# EAGLE design MxxxCol (EAGLE 6.6.0)

## Sheet 1 of 6
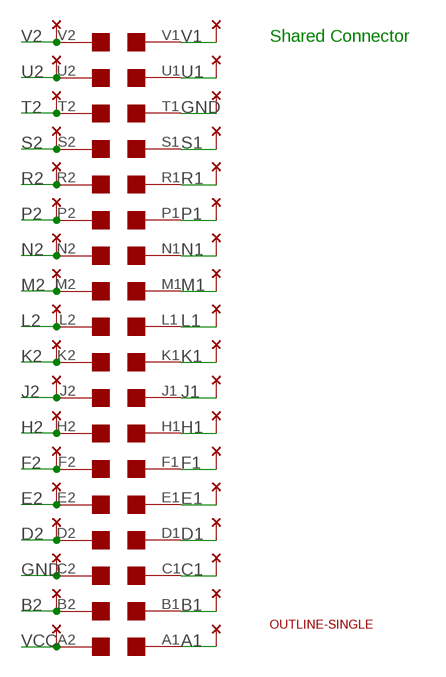
[diagram p0: schematic, sheet 1]

### Parts
U$1  EDGE-2CONNECTOR  [EDGE-CON2]
U$2  OUTLINE-SINGLE  [SINGLE]
U$4  THRU-HOLE2A  [THRU-HOLEA]

### Nets
A1: U$1.A1 U$4.A1 ; also sheet 2,3,4,5,6
B1: U$1.B1 U$4.B1 ; also sheet 2,3,4,5,6
B2: U$1.B2 U$4.B2
C1: U$1.C1 U$4.C1 ; also sheet 2,3,4,5,6
D1: U$1.D1 U$4.D1 ; also sheet 2,3,4,5,6
D2: U$1.D2 U$4.D2 ; also sheet 2,3,4,5,6
E1: U$1.E1 U$4.E1 ; also sheet 2,3,4,5
E2: U$1.E2 U$4.E2 ; also sheet 2,3,4,5,6
F1: U$1.F1 U$4.F1 ; also sheet 2,3,4,5,6
F2: U$1.F2 U$4.F2 ; also sheet 2,3,4,5,6
GND [Power]: U$1.C2 U$1.T1 U$4.C2 U$4.T1 ; also sheet 2,3,4,5,6
H1: U$1.H1 U$4.H1 ; also sheet 2,3,4,5,6
H2: U$1.H2 U$4.H2 ; also sheet 2,3,4,5,6
J1: U$1.J1 U$4.J1 ; also sheet 2,3,4,5,6
J2: U$1.J2 U$4.J2 ; also sheet 2,3,4,5,6
K1: U$1.K1 U$4.K1 ; also sheet 2,3,4,5,6
K2: U$1.K2 U$4.K2 ; also sheet 2,3,4,5,6
L1: U$1.L1 U$4.L1 ; also sheet 2,3,4,5
L2: U$1.L2 U$4.L2 ; also sheet 2,3,4,5,6
M1: U$1.M1 U$4.M1 ; also sheet 2,3,4,5,6
M2: U$1.M2 U$4.M2 ; also sheet 2,3,4,5,6
N1: U$1.N1 U$4.N1 ; also sheet 2,3,4,5,6
N2: U$1.N2 U$4.N2 ; also sheet 2,3,4,5,6
P1: U$1.P1 U$4.P1 ; also sheet 2,3,4,5,6
P2: U$1.P2 U$4.P2 ; also sheet 2,3,4,5,6
R1: U$1.R1 U$4.R1 ; also sheet 2,3,4,5,6
R2: U$1.R2 U$4.R2 ; also sheet 2,3,4,5,6
S1: U$1.S1 U$4.S1 ; also sheet 2,3,4,5
S2: U$1.S2 U$4.S2 ; also sheet 2,3,4,5,6
T2: U$1.T2 U$4.T2 ; also sheet 2,3,4,5,6
U1: U$1.U1 U$4.U1 ; also sheet 2,3,4
U2: U$1.U2 U$4.U2 ; also sheet 2,3,4,5,6
V1: U$1.V1 U$4.V1 ; also sheet 2,3,4
V2: U$1.V2 U$4.V2 ; also sheet 2,3,4,5,6
VCC [Power]: U$1.A2 U$4.A2 ; also sheet 2,3,4,5,6

### Notes on the sheet
- Shared Connector

## Sheet 2 of 6
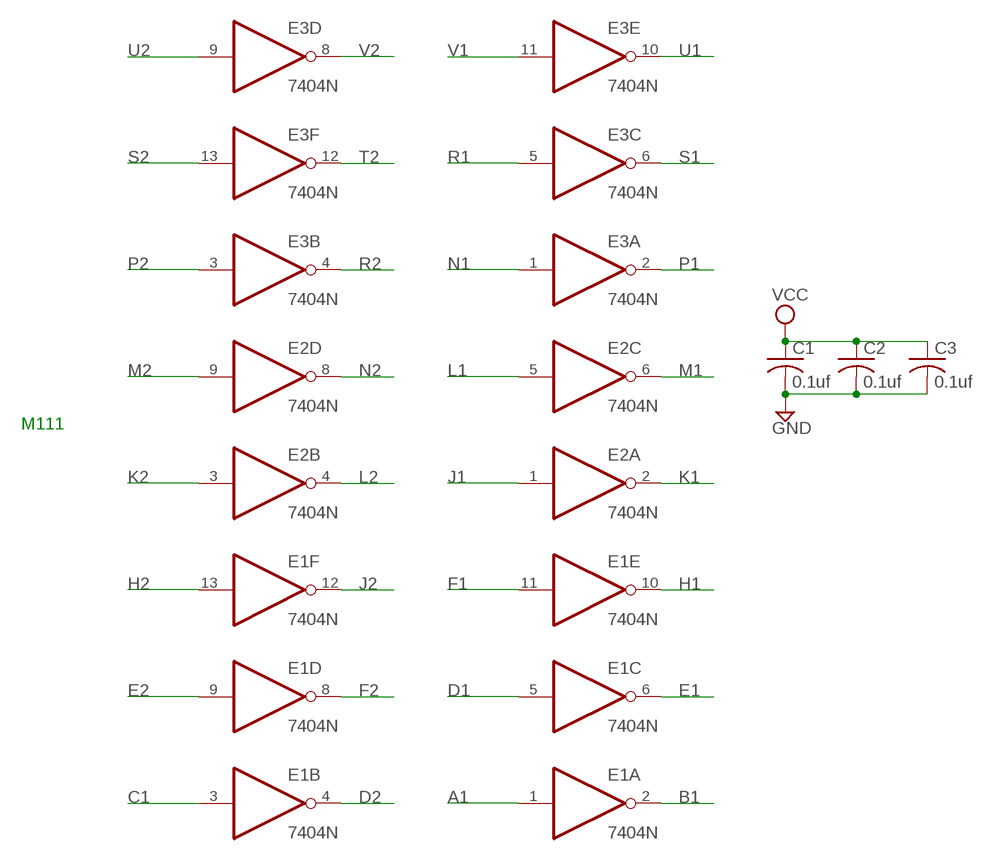
[diagram p1: schematic, sheet 2]

### Parts
C1  0.1uf  C-US050-025X075  [C050-025X075]
C2  0.1uf  C-US050-025X075  [C050-025X075]
C3  0.1uf  C-US050-025X075  [C050-025X075]
E1  7404N  [DIL14]
E2  7404N  [DIL14]
E3  7404N  [DIL14]

### Nets
A1: E1.1(A:I) ; also sheet 1,3,4,5,6
B1: E1.2(A:O) ; also sheet 1,3,4,5,6
C1: E1.3(B:I) ; also sheet 1,3,4,5,6
D1: E1.5(C:I) ; also sheet 1,3,4,5,6
D2: E1.4(B:O) ; also sheet 1,3,4,5,6
E1: E1.6(C:O) ; also sheet 1,3,4,5
E2: E1.9(D:I) ; also sheet 1,3,4,5,6
F1: E1.11(E:I) ; also sheet 1,3,4,5,6
F2: E1.8(D:O) ; also sheet 1,3,4,5,6
GND [Power]: C1.2 C2.2 C3.2 ; also sheet 1,3,4,5,6
H1: E1.10(E:O) ; also sheet 1,3,4,5,6
H2: E1.13(F:I) ; also sheet 1,3,4,5,6
J1: E2.1(A:I) ; also sheet 1,3,4,5,6
J2: E1.12(F:O) ; also sheet 1,3,4,5,6
K1: E2.2(A:O) ; also sheet 1,3,4,5,6
K2: E2.3(B:I) ; also sheet 1,3,4,5,6
L1: E2.5(C:I) ; also sheet 1,3,4,5
L2: E2.4(B:O) ; also sheet 1,3,4,5,6
M1: E2.6(C:O) ; also sheet 1,3,4,5,6
M2: E2.9(D:I) ; also sheet 1,3,4,5,6
N1: E3.1(A:I) ; also sheet 1,3,4,5,6
N2: E2.8(D:O) ; also sheet 1,3,4,5,6
P1: E3.2(A:O) ; also sheet 1,3,4,5,6
P2: E3.3(B:I) ; also sheet 1,3,4,5,6
R1: E3.5(C:I) ; also sheet 1,3,4,5,6
R2: E3.4(B:O) ; also sheet 1,3,4,5,6
S1: E3.6(C:O) ; also sheet 1,3,4,5
S2: E3.13(F:I) ; also sheet 1,3,4,5,6
T2: E3.12(F:O) ; also sheet 1,3,4,5,6
U1: E3.10(E:O) ; also sheet 1,3,4
U2: E3.9(D:I) ; also sheet 1,3,4,5,6
V1: E3.11(E:I) ; also sheet 1,3,4
V2: E3.8(D:O) ; also sheet 1,3,4,5,6
VCC [Power]: C1.1 C2.1 C3.1 ; also sheet 1,3,4,5,6
Unconnected: E2.10(E:O) E2.11(E:I) E2.12(F:O) E2.13(F:I)

### Notes on the sheet
- M111

## Sheet 3 of 6
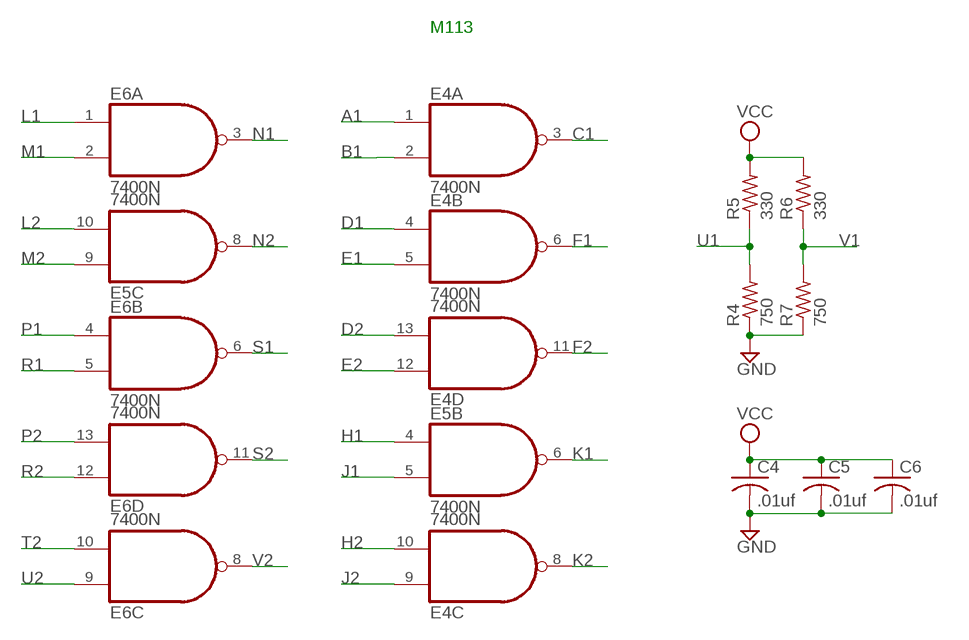
[diagram p2: schematic, sheet 3]

### Parts
C4  .01uf  C-US050-025X075  [C050-025X075]
C5  .01uf  C-US050-025X075  [C050-025X075]
C6  .01uf  C-US050-025X075  [C050-025X075]
E4  7400N  [DIL14]
E5  7400N  [DIL14]
E6  7400N  [DIL14]
R4  750  R-US_0207/10  [0207/10]
R5  330  R-US_0207/10  [0207/10]
R6  330  R-US_0207/10  [0207/10]
R7  750  R-US_0207/10  [0207/10]

### Nets
A1: E4.1(A:I0) ; also sheet 1,2,4,5,6
B1: E4.2(A:I1) ; also sheet 1,2,4,5,6
C1: E4.3(A:O) ; also sheet 1,2,4,5,6
D1: E4.4(B:I0) ; also sheet 1,2,4,5,6
D2: E4.13(D:I1) ; also sheet 1,2,4,5,6
E1: E4.5(B:I1) ; also sheet 1,2,4,5
E2: E4.12(D:I0) ; also sheet 1,2,4,5,6
F1: E4.6(B:O) ; also sheet 1,2,4,5,6
F2: E4.11(D:O) ; also sheet 1,2,4,5,6
GND [Power]: C4.2 C5.2 C6.2 R4.1 R7.1 ; also sheet 1,2,4,5,6
H1: E5.4(B:I0) ; also sheet 1,2,4,5,6
H2: E4.10(C:I1) ; also sheet 1,2,4,5,6
J1: E5.5(B:I1) ; also sheet 1,2,4,5,6
J2: E4.9(C:I0) ; also sheet 1,2,4,5,6
K1: E5.6(B:O) ; also sheet 1,2,4,5,6
K2: E4.8(C:O) ; also sheet 1,2,4,5,6
L1: E6.1(A:I0) ; also sheet 1,2,4,5
L2: E5.10(C:I1) ; also sheet 1,2,4,5,6
M1: E6.2(A:I1) ; also sheet 1,2,4,5,6
M2: E5.9(C:I0) ; also sheet 1,2,4,5,6
N1: E6.3(A:O) ; also sheet 1,2,4,5,6
N2: E5.8(C:O) ; also sheet 1,2,4,5,6
P1: E6.4(B:I0) ; also sheet 1,2,4,5,6
P2: E6.13(D:I1) ; also sheet 1,2,4,5,6
R1: E6.5(B:I1) ; also sheet 1,2,4,5,6
R2: E6.12(D:I0) ; also sheet 1,2,4,5,6
S1: E6.6(B:O) ; also sheet 1,2,4,5
S2: E6.11(D:O) ; also sheet 1,2,4,5,6
T2: E6.10(C:I1) ; also sheet 1,2,4,5,6
U1: R4.2 R5.1 ; also sheet 1,2,4
U2: E6.9(C:I0) ; also sheet 1,2,4,5,6
V1: R6.1 R7.2 ; also sheet 1,2,4
V2: E6.8(C:O) ; also sheet 1,2,4,5,6
VCC [Power]: C4.1 C5.1 C6.1 R5.2 R6.2 ; also sheet 1,2,4,5,6
Unconnected: E5.1(A:I0) E5.2(A:I1) E5.3(A:O) E5.11(D:O) E5.12(D:I0) E5.13(D:I1)

### Notes on the sheet
- M113

## Sheet 4 of 6
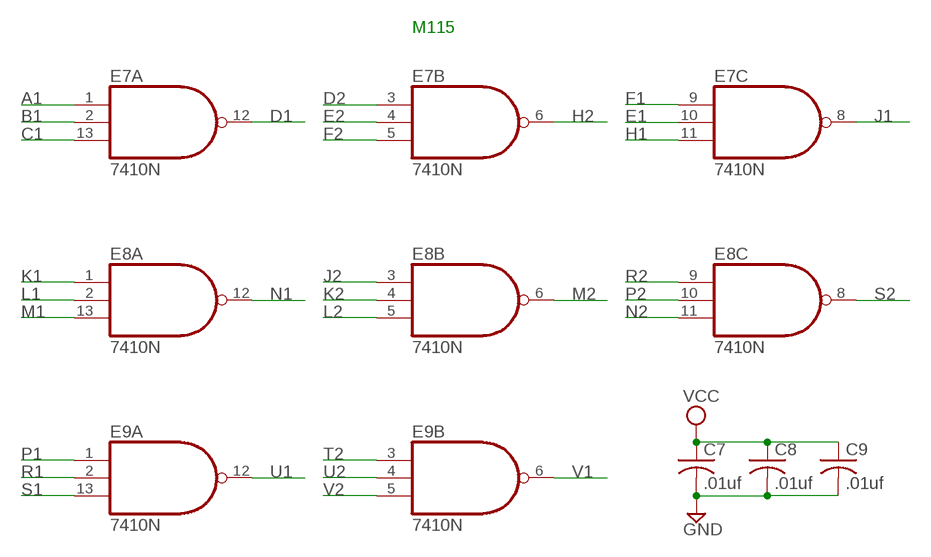
[diagram p3: schematic, sheet 4]

### Parts
C7  .01uf  C-US050-025X075  [C050-025X075]
C8  .01uf  C-US050-025X075  [C050-025X075]
C9  .01uf  C-US050-025X075  [C050-025X075]
E7  7410N  [DIL14]
E8  7410N  [DIL14]
E9  7410N  [DIL14]

### Nets
A1: E7.1(A:I0) ; also sheet 1,2,3,5,6
B1: E7.2(A:I1) ; also sheet 1,2,3,5,6
C1: E7.13(A:I2) ; also sheet 1,2,3,5,6
D1: E7.12(A:O) ; also sheet 1,2,3,5,6
D2: E7.3(B:I0) ; also sheet 1,2,3,5,6
E1: E7.10(C:I1) ; also sheet 1,2,3,5
E2: E7.4(B:I1) ; also sheet 1,2,3,5,6
F1: E7.9(C:I0) ; also sheet 1,2,3,5,6
F2: E7.5(B:I2) ; also sheet 1,2,3,5,6
GND [Power]: C7.2 C8.2 C9.2 ; also sheet 1,2,3,5,6
H1: E7.11(C:I2) ; also sheet 1,2,3,5,6
H2: E7.6(B:O) ; also sheet 1,2,3,5,6
J1: E7.8(C:O) ; also sheet 1,2,3,5,6
J2: E8.3(B:I0) ; also sheet 1,2,3,5,6
K1: E8.1(A:I0) ; also sheet 1,2,3,5,6
K2: E8.4(B:I1) ; also sheet 1,2,3,5,6
L1: E8.2(A:I1) ; also sheet 1,2,3,5
L2: E8.5(B:I2) ; also sheet 1,2,3,5,6
M1: E8.13(A:I2) ; also sheet 1,2,3,5,6
M2: E8.6(B:O) ; also sheet 1,2,3,5,6
N1: E8.12(A:O) ; also sheet 1,2,3,5,6
N2: E8.11(C:I2) ; also sheet 1,2,3,5,6
P1: E9.1(A:I0) ; also sheet 1,2,3,5,6
P2: E8.10(C:I1) ; also sheet 1,2,3,5,6
R1: E9.2(A:I1) ; also sheet 1,2,3,5,6
R2: E8.9(C:I0) ; also sheet 1,2,3,5,6
S1: E9.13(A:I2) ; also sheet 1,2,3,5
S2: E8.8(C:O) ; also sheet 1,2,3,5,6
T2: E9.3(B:I0) ; also sheet 1,2,3,5,6
U1: E9.12(A:O) ; also sheet 1,2,3
U2: E9.4(B:I1) ; also sheet 1,2,3,5,6
V1: E9.6(B:O) ; also sheet 1,2,3
V2: E9.5(B:I2) ; also sheet 1,2,3,5,6
VCC [Power]: C7.1 C8.1 C9.1 ; also sheet 1,2,3,5,6
Unconnected: E9.8(C:O) E9.9(C:I0) E9.10(C:I1) E9.11(C:I2)

### Notes on the sheet
- M115

## Sheet 5 of 6
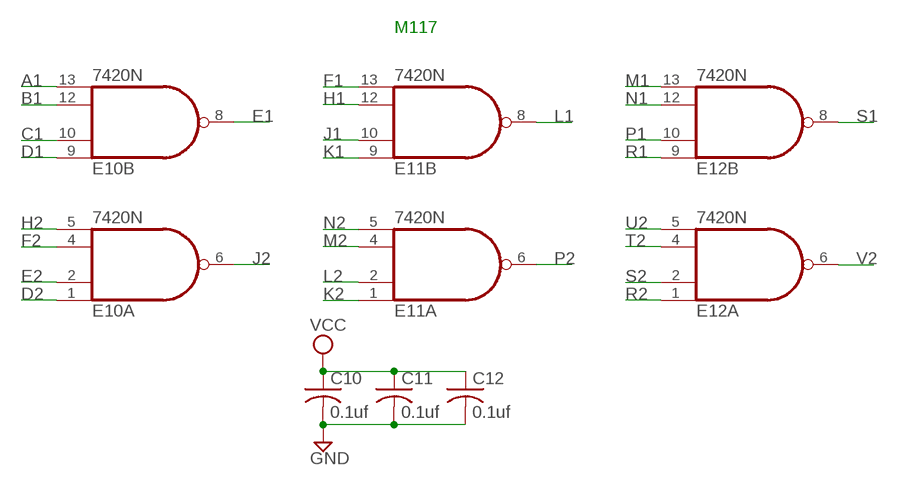
[diagram p4: schematic, sheet 5]

### Parts
C10  0.1uf  C-US050-025X075  [C050-025X075]
C11  0.1uf  C-US050-025X075  [C050-025X075]
C12  0.1uf  C-US050-025X075  [C050-025X075]
E10  7420N  74S20N  [DIL14]
E11  7420N  74S20N  [DIL14]
E12  7420N  74S20N  [DIL14]

### Nets
A1: E10.13(B:I3) ; also sheet 1,2,3,4,6
B1: E10.12(B:I2) ; also sheet 1,2,3,4,6
C1: E10.10(B:I1) ; also sheet 1,2,3,4,6
D1: E10.9(B:I0) ; also sheet 1,2,3,4,6
D2: E10.1(A:I0) ; also sheet 1,2,3,4,6
E1: E10.8(B:O) ; also sheet 1,2,3,4
E2: E10.2(A:I1) ; also sheet 1,2,3,4,6
F1: E11.13(B:I3) ; also sheet 1,2,3,4,6
F2: E10.4(A:I2) ; also sheet 1,2,3,4,6
GND [Power]: C10.2 C11.2 C12.2 ; also sheet 1,2,3,4,6
H1: E11.12(B:I2) ; also sheet 1,2,3,4,6
H2: E10.5(A:I3) ; also sheet 1,2,3,4,6
J1: E11.10(B:I1) ; also sheet 1,2,3,4,6
J2: E10.6(A:O) ; also sheet 1,2,3,4,6
K1: E11.9(B:I0) ; also sheet 1,2,3,4,6
K2: E11.1(A:I0) ; also sheet 1,2,3,4,6
L1: E11.8(B:O) ; also sheet 1,2,3,4
L2: E11.2(A:I1) ; also sheet 1,2,3,4,6
M1: E12.13(B:I3) ; also sheet 1,2,3,4,6
M2: E11.4(A:I2) ; also sheet 1,2,3,4,6
N1: E12.12(B:I2) ; also sheet 1,2,3,4,6
N2: E11.5(A:I3) ; also sheet 1,2,3,4,6
P1: E12.10(B:I1) ; also sheet 1,2,3,4,6
P2: E11.6(A:O) ; also sheet 1,2,3,4,6
R1: E12.9(B:I0) ; also sheet 1,2,3,4,6
R2: E12.1(A:I0) ; also sheet 1,2,3,4,6
S1: E12.8(B:O) ; also sheet 1,2,3,4
S2: E12.2(A:I1) ; also sheet 1,2,3,4,6
T2: E12.4(A:I2) ; also sheet 1,2,3,4,6
U2: E12.5(A:I3) ; also sheet 1,2,3,4,6
V2: E12.6(A:O) ; also sheet 1,2,3,4,6
VCC [Power]: C10.1 C11.1 C12.1 ; also sheet 1,2,3,4,6

### Notes on the sheet
- M117

## Sheet 6 of 6
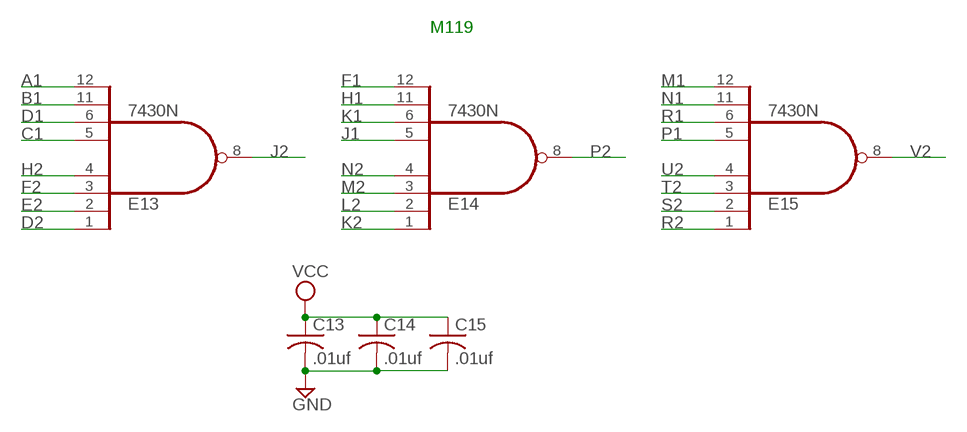
[diagram p5: schematic, sheet 6]

### Parts
C13  .01uf  C-US050-025X075  [C050-025X075]
C14  .01uf  C-US050-025X075  [C050-025X075]
C15  .01uf  C-US050-025X075  [C050-025X075]
E13  7430N  [DIL14]
E14  7430N  [DIL14]
E15  7430N  [DIL14]

### Nets
A1: E13.12(I7) ; also sheet 1,2,3,4,5
B1: E13.11(I6) ; also sheet 1,2,3,4,5
C1: E13.5(I4) ; also sheet 1,2,3,4,5
D1: E13.6(I5) ; also sheet 1,2,3,4,5
D2: E13.1(I0) ; also sheet 1,2,3,4,5
E2: E13.2(I1) ; also sheet 1,2,3,4,5
F1: E14.12(I7) ; also sheet 1,2,3,4,5
F2: E13.3(I2) ; also sheet 1,2,3,4,5
GND [Power]: C13.2 C14.2 C15.2 ; also sheet 1,2,3,4,5
H1: E14.11(I6) ; also sheet 1,2,3,4,5
H2: E13.4(I3) ; also sheet 1,2,3,4,5
J1: E14.5(I4) ; also sheet 1,2,3,4,5
J2: E13.8(O) ; also sheet 1,2,3,4,5
K1: E14.6(I5) ; also sheet 1,2,3,4,5
K2: E14.1(I0) ; also sheet 1,2,3,4,5
L2: E14.2(I1) ; also sheet 1,2,3,4,5
M1: E15.12(I7) ; also sheet 1,2,3,4,5
M2: E14.3(I2) ; also sheet 1,2,3,4,5
N1: E15.11(I6) ; also sheet 1,2,3,4,5
N2: E14.4(I3) ; also sheet 1,2,3,4,5
P1: E15.5(I4) ; also sheet 1,2,3,4,5
P2: E14.8(O) ; also sheet 1,2,3,4,5
R1: E15.6(I5) ; also sheet 1,2,3,4,5
R2: E15.1(I0) ; also sheet 1,2,3,4,5
S2: E15.2(I1) ; also sheet 1,2,3,4,5
T2: E15.3(I2) ; also sheet 1,2,3,4,5
U2: E15.4(I3) ; also sheet 1,2,3,4,5
V2: E15.8(O) ; also sheet 1,2,3,4,5
VCC [Power]: C13.1 C14.1 C15.1 ; also sheet 1,2,3,4,5

### Notes on the sheet
- M119

## Power pins joined to a net without a drawn wire
GND: E1.7(P:GND) E2.7(P:GND) E3.7(P:GND) E4.7(P:GND) E5.7(P:GND) E6.7(P:GND) E7.7(P:GND) E8.7(P:GND) E9.7(P:GND) E10.7(P:GND) E11.7(P:GND) E12.7(P:GND) E13.7(GND) E14.7(GND) E15.7(GND)
VCC: E1.14(P:VCC) E2.14(P:VCC) E3.14(P:VCC) E4.14(P:VCC) E5.14(P:VCC) E6.14(P:VCC) E7.14(P:VCC) E8.14(P:VCC) E9.14(P:VCC) E10.14(P:VCC) E11.14(P:VCC) E12.14(P:VCC) E13.14(VCC) E14.14(VCC) E15.14(VCC)

## Library data of the parts
C1-C15 = rcl:C-US: CAPACITOR, American symbol
E1-E3 = 74xx-us:74*04: Hex INVERTER
E4-E6 = 74xx-us:74*00: Quad 2-input NAND gate
E7-E9 = 74xx-us:74*10: Triple 3-input NAND gate
E10-E12 = 74xx-us:74*20: Dual 4-input NAND gate
E13-E15 = 74xx-us:74*30: 8-input NAND gate
R4-R7 = rcl:R-US_: RESISTOR, American symbol
U$1 = dec-con:EDGE-2: Double-Sided DEC edge connector.
U$2 = dec-con:OUTLINE-*: Board outlines for DEC boards.
U$4 = dec-con:THRU-HOLE2: Thru-Hole addition to double-sided edge connector.

## Net classes
1 Power: width 0.381 mm

## Board
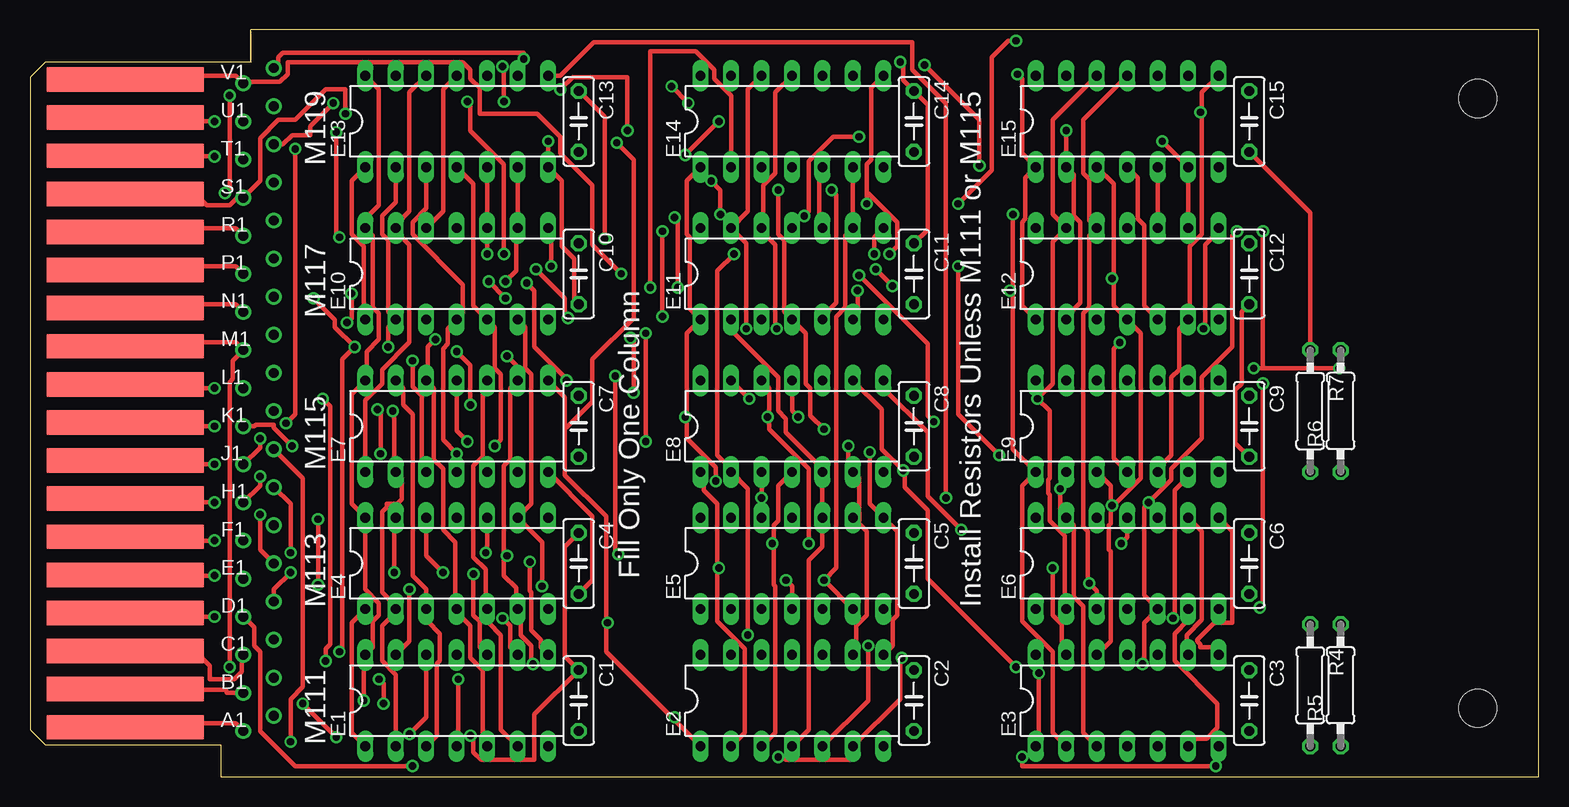
[diagram p6: board, top side]
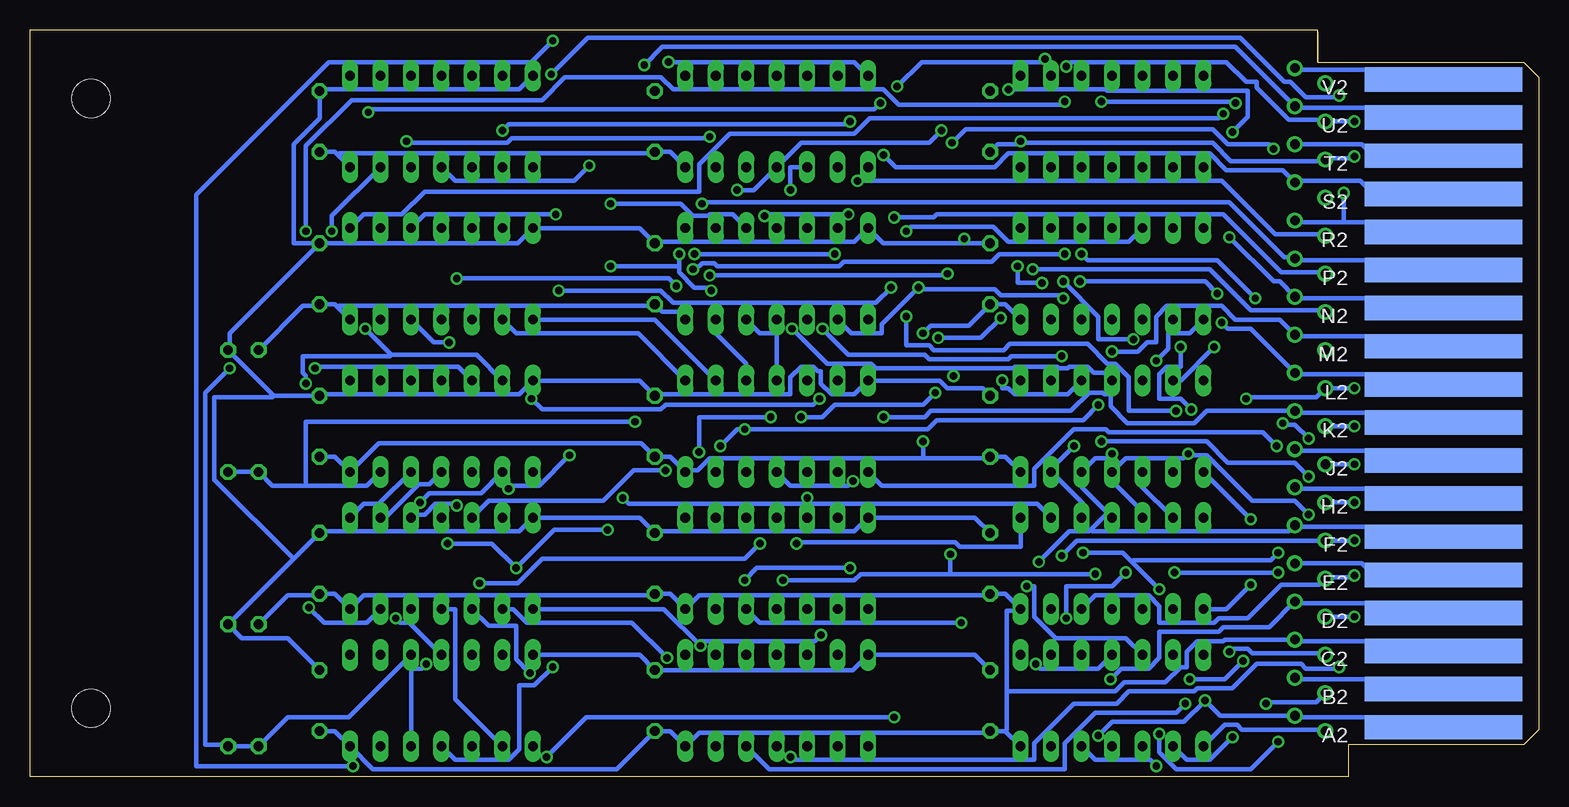
[diagram p7: board, bottom side, seen from below]

Size 125.73 x 62.23 mm. Coordinates in mm from the lower left corner, seen from the top.
Copper layers (1*16): Top 0.035mm / dielectric 1.5mm / Bottom 0.035mm
Design rules "15mils": minimum track width 15mil, minimum drill 24mil, track to track 15mil, track to pad 10mil, pad to pad 10mil, via to via 10mil, smd to smd 10mil, copper to edge 13mil, drill to drill 10mil, minimum pad ring 10mil, minimum via ring 8mil, stop-mask expansion 0mil, vias tented up to drill 0mil, thermal gap 10mil

### Footprints (pad centres in the part's own frame; a part is rotated, then mirrored left to right if it is on the bottom)
C050-025X075 = drill 0.813 octagon: 1 -2.54,0; 2 2.54,0
DIL14 = drill 0.813 long: 1 -7.62,-3.81; 2 -5.08,-3.81; 3 -2.54,-3.81; 4 0,-3.81; 5 2.54,-3.81; 6 5.08,-3.81; 7 7.62,-3.81; 8 7.62,3.81; 9 5.08,3.81; 10 2.54,3.81; 11 0,3.81; 12 -2.54,3.81; 13 -5.08,3.81; 14 -7.62,3.81
0207/10 = drill 0.813 octagon: 1 -5.08,0; 2 5.08,0
EDGE-CON2 = smd 13.106 x 2.032: A1 7.938,4.128; B1 7.938,7.303; C1 7.938,10.477; D1 7.938,13.652; E1 7.938,16.828; F1 7.938,20.003; H1 7.938,23.177; J1 7.938,26.352; K1 7.938,29.527; L1 7.938,32.703; M1 7.938,35.877; N1 7.938,39.053; P1 7.938,42.227; R1 7.938,45.403; S1 7.938,48.578; T1 7.938,51.752; U1 7.938,54.928; V1 7.938,58.102 | smd 13.106 x 2.032 bottom: A2 7.938,4.128; B2 7.938,7.303; C2 7.938,10.477; D2 7.938,13.652; E2 7.938,16.828; F2 7.938,20.003; H2 7.938,23.177; J2 7.938,26.352; K2 7.938,29.527; L2 7.938,32.703; M2 7.938,35.877; N2 7.938,39.053; P2 7.938,42.227; R2 7.938,45.403; S2 7.938,48.578; T2 7.938,51.752; U2 7.938,54.928; V2 7.938,58.102
SINGLE = hole 3.175: 120.65,56.515; 120.65,5.715
THRU-HOLEA = drill 0.813 pad 1.27: A1 17.78,3.81; A2 20.32,5.08; B1 17.78,6.985; B2 20.32,8.255; C1 17.78,10.16; C2 20.32,11.43; D1 17.78,13.335; D2 20.32,14.605; E1 17.78,16.51; E2 20.32,17.78; F1 17.78,19.685; F2 20.32,20.955; H1 17.78,22.86; H2 20.32,24.13; J1 17.78,26.035; J2 20.32,27.305; K1 17.78,29.21; K2 20.32,30.48; L1 17.78,32.385; L2 20.32,33.655; M1 17.78,35.56; M2 20.32,36.83; N1 17.78,38.735; N2 20.32,40.005; P1 17.78,41.91; P2 20.32,43.18; R1 17.78,45.085; R2 20.32,46.355; S1 17.78,48.26; S2 20.32,49.53; T1 17.78,51.435; T2 20.32,52.705; U1 17.78,54.61; U2 20.32,55.88; V1 17.78,57.785; V2 20.32,59.055

### Placement (x,y rotation side)
C1  45.72,6.35 270 top
C2  73.66,6.35 270 top
C3  101.6,6.35 270 top
C4  45.72,17.78 270 top
C5  73.66,17.78 270 top
C6  101.6,17.78 270 top
C7  45.72,29.21 270 top
C8  73.66,29.21 270 top
C9  101.6,29.21 270 top
C10  45.72,41.91 270 top
C11  73.66,41.91 270 top
C12  101.6,41.91 270 top
C13  45.72,54.61 270 top
C14  73.66,54.61 270 top
C15  101.6,54.61 270 top
E1  35.56,6.35 0 top
E2  63.5,6.35 0 top
E3  91.44,6.35 0 top
E4  35.56,17.78 0 top
E5  63.5,17.78 0 top
E6  91.44,17.78 0 top
E7  35.56,29.21 0 top
E8  63.5,29.21 0 top
E9  91.44,29.21 0 top
E10  35.56,41.91 0 top
E11  63.5,41.91 0 top
E12  91.44,41.91 0 top
E13  35.56,54.61 0 top
E14  63.5,54.61 0 top
E15  91.44,54.61 0 top
R4  106.68,7.62 270 top
R5  109.22,7.62 90 top
R6  109.22,30.48 90 top
R7  106.68,30.48 270 top
U$1  0,0 0 top
U$2  0,0 0 top
U$4  0,0 0 top

### Tracks (layer width: path | path; a pad name or v marks a point on that pad's centre or on a via)
A1  (via drill 0.61)
  Top 0.381: E7.1 27.94,31.37 29.34,32.77 29.34,33.91 31.62,36.2 31.62,44.32 30.48,45.47 E10.13 30.61,45.85 30.61,46.1 31.62,47.12 31.62,57.02 E13.12 | E4.1 26.8,12.83 26.8,3.68 E1.1 | U$4.A1 17.15,4.45 8,4.45 8,4.19 U$1.A1 | v24,16 v24,21.46
  Bottom 0.381: U$4.A1 17.91,3.94 24.77,3.94 25.15,4.32 26.16,4.32 E1.1 | v24,21.46 E7.1 | v24,16 26.04,13.97 E4.1
B1  (via drill 0.61)
  Top 0.381: U$4.B1 16.38,6.99 16.38,7.11 16.26,7.24 8,7.24 U$1.B1 | E10.12 34.42,47.12 34.42,57.28 E13.11 | E1.2 30.48,8.51 29.34,9.65 29.34,12.57 30.48,13.72 E4.2 30.35,14.1 30.35,14.35 29.34,15.37 29.34,22.1 29.72,22.48 29.72,22.73 30.61,22.73 30.99,23.11 30.99,24.89 E7.2 30.35,25.53 30.35,30.35 v30.23,30.48 | v52.71,38.35 v52.71,45.47 | v25.53,3.3 v22.73,6.1
  Bottom 0.381: E10.12 34.16,44.58 44.2,44.58 45.47,45.85 52.32,45.85 v52.71,45.47 | v52.71,38.35 52.71,35.94 50.8,35.94 50.42,35.56 44.58,35.56 44.07,36.07 37.59,36.07 35.94,34.42 35.31,34.42 34.16,33.27 34.16,30.48 v30.23,30.48 | U$4.B1 18.54,6.22 22.61,6.22 v22.73,6.1 | v25.53,3.3 27.43,1.4 29.34,1.4 E1.2
B2
  Bottom 0.381: U$4.B2 20.19,8.13 8.76,8.13 U$1.B2
C1  (via drill 0.61)
  Top 0.381: U$4.C1 17.65,10.03 17.65,8.76 17.02,8.13 14.99,8.13 14.99,9.27 13.84,10.41 8,10.41 U$1.C1 | E13.5 E10.10 v38.1,43.56 | E7.13 31.12,32.38 31.12,30.99 31.88,30.23 31.88,16.76 33.02,15.62 E4.3 33.15,13.84 33.15,12.95 34.16,11.94 34.16,9.65 33.91,9.4 33.91,3.43 E1.3 | v23.62,39.88 25.4,38.1 25.4,37.47 v27.05,35.81 26.04,34.8 26.04,10.67 v25.78,10.41
  Bottom 0.381: v38.1,43.56 37.59,43.05 26.8,43.05 v23.62,39.88 | v27.05,35.81 29.85,33.02 E7.13 | U$4.C1 17.91,10.29 23.88,10.29 24.26,10.67 25.53,10.67 v25.78,10.41
D1  (via drill 0.61)
  Top 0.381: v15.37,13.34 8,13.34 8,13.59 U$1.D1 | E13.6 E10.9 40.51,45.59 40.51,42.16 v39.62,41.27 | E1.5 37.72,2.92 37.72,8.89 36.7,9.91 36.7,12.57 35.56,13.72 E4.4 35.43,14.1 35.43,19.56 34.42,20.57 34.42,25.65 33.66,26.42 33.66,32.38 E7.12 33.15,33.15 33.15,35.81 v33.78,36.45 | U$4.D1 18.67,12.45 18.67,10.92 19.18,10.41 19.18,3.81 22.1,0.89 v31.88,0.89
  Bottom 0.381: v15.37,13.34 U$4.D1 | v39.62,41.27 36.7,38.35 36.7,36.45 v33.78,36.45 | v31.88,0.89 32.39,1.4 36.96,1.4 E1.5
D2  (via drill 0.61)
  Top 0.381: E10.1 27.81,38.23 27.81,44.2 26.8,45.21 26.8,49.66 E13.1 | E7.3 32.64,25.78 32.64,31.75 31.88,32.51 v31.88,34.67 | E1.4 35.69,2.67 v35.69,8.13 | E4.13 30.35,21.46 v30.35,17.02 | v21.72,17.02 20.32,15.62 U$4.D2
  Bottom 0.381: E4.13 33.15,24.26 33.15,25.4 E7.3 | v31.88,34.67 30.86,35.69 30.86,36.96 29.08,36.96 E10.1 | v35.69,8.13 34.8,9.02 32.51,9.02 31.62,9.91 31.62,12.06 26.67,12.06 26.29,12.45 22.48,12.45 U$4.D2 20.19,14.48 8.76,14.48 U$1.D2 | v21.72,17.02 v30.35,17.02
E1  (via drill 0.61)
  Top 0.381: E1.6 39.24,3.94 39.24,11.81 38.23,12.83 38.23,13.84 E4.5 37.97,14.1 37.97,17.27 36.96,18.29 36.96,25.91 37.72,26.67 37.72,32.64 E7.10 | E10.8 43.43,45.47 v43.43,42.55 | v41.4,41.15 42.04,40.51 42.04,35.81 44.7,33.15 v44.7,33.02 | v15.37,16.76 8,16.76 U$1.E1
  Bottom 0.381: E4.5 36.96,15.11 32.51,15.11 31.62,14.22 31.62,12.83 27.05,12.83 26.67,13.21 24.26,13.21 21.46,16 18.29,16 U$4.E1 17.65,16.64 15.49,16.64 v15.37,16.76 | v43.43,42.55 43.43,41.15 v41.4,41.15 | v44.7,33.02 44.7,32.38 44.2,32.38 43.69,31.88 39.24,31.88 E7.10
E2  (via drill 0.61)
  Top 0.381: E13.2 30.48,47.88 29.34,46.74 29.34,45.21 29.85,44.7 29.85,38.73 E10.2 29.85,37.47 v29.85,35.81 | E1.9 40.01,10.79 40.01,12.57 v39.37,13.21 | v34.42,17.02 33.02,18.41 E4.12 | v28.96,30.61 29.21,30.35 v29.21,26.92 | U$4.E2 19.18,18.92 v19.18,21.84
  Bottom 0.381: U$4.E2 14.73,17.78 13.84,16.89 8,16.89 U$1.E2 | E4.12 33.02,22.1 35.56,24.64 E7.4 34.42,26.54 29.59,26.54 v29.21,26.92 29.08,26.8 27.69,26.8 23.88,22.99 20.32,22.99 v19.18,21.84 | v39.37,13.21 39.37,15.88 35.56,15.88 v34.42,17.02 | v29.85,35.81 29.85,34.16 30.99,34.16 31.62,33.53 31.62,31.5 29.85,31.5 v28.96,30.61
F1  (via drill 0.61)
  Top 0.381: v15.37,19.68 8,19.68 8,19.94 U$1.F1 | E14.12 59.82,57.28 59.82,47.12 E11.13 59.69,44.45 v59.69,37.34 | v41.91,9.4 41.78,9.53 41.78,10.92 40.89,11.81 40.89,13.72 E4.6 40.51,14.1 40.51,15.75 39.5,16.76 39.5,18.41 | 39.5,18.41 39.5,25.91 40.01,26.42 40.01,32.38 E7.9 40.51,33.15 40.51,34.29 v39.75,35.05 | v39.75,18.41 39.5,18.41
  Bottom 0.381: v15.37,19.68 U$4.F1 38.48,19.68 v39.75,18.41 | E1.11 36.7,9.02 41.53,9.02 v41.91,9.4 | v59.69,37.34 57.53,35.18 51.18,35.18 50.8,34.8 44.2,34.8 43.94,35.05 v39.75,35.05
F2  (via drill 0.61)
  Top 0.381: E13.3 33.02,47.37 31.88,46.23 31.88,45.21 36.07,41.02 36.07,38.61 E10.4 34.8,37.34 34.8,36.07 34.42,35.69 34.42,28.07 v35.56,26.92 | E1.8 42.55,10.79 42.55,11.43 41.78,12.19 41.78,15.37 41.66,15.49 v41.66,17.91
  Bottom 0.381: U$1.F2 8.76,20.83 20.19,20.83 U$4.F2 20.83,20.45 37.21,20.45 37.34,20.57 | v41.66,17.91 39.12,20.45 37.47,20.45 37.34,20.57 | 37.34,20.57 36.07,21.84 E4.11 38.1,24.13 E7.5 36.96,26.54 35.94,26.54 v35.56,26.92
GND  (via drill 0.61)
  Top 0.381: v43.18,52.96 E13.7 44.32,49.66 44.32,44.2 45.34,43.18 45.34,39.75 C10.2 | v15.37,51.69 8,51.69 U$1.T1 | C15.2 106.68,46.99 R7.1 | C12.2 100.97,38.73 100.97,32.77 100.46,32.26 100.46,27.81 C9.2 | v51.31,27.94 v51.31,36.96 | C4.2 46.86,16.38 46.86,21.72 E7.7
  Bottom 0.381: U$1.C2 8.76,11.3 20.19,11.3 U$4.C2 26.16,11.43 26.29,11.3 28.45,11.3 29.34,10.41 29.34,9.14 29.85,9.14 31.12,7.87 34.54,7.87 35.31,7.11 44.32,7.11 | R4.1 104.27,15.11 101.73,15.11 C6.2 100.33,15.24 E6.7 97.92,15.11 73.79,15.11 C5.2 72.39,15.24 E5.7 69.98,15.11 45.85,15.11 C4.2 44.45,15.24 E4.7 43.31,13.84 44.32,13.84 44.32,7.11 | C3.2 100.33,3.81 E3.7 97.16,0.64 76.84,0.64 C2.2 72.39,3.81 E2.7 69.98,3.68 45.85,3.68 C1.2 44.45,3.81 | 44.45,3.81 E1.7 | 44.32,7.11 44.32,3.94 44.45,3.81 | E10.7 44.45,39.37 C10.2 47.5,37.59 50.67,37.59 v51.31,36.96 | C13.2 45.09,52.7 43.43,52.7 v43.18,52.96 43.05,52.83 27.18,52.83 25.65,51.31 17.91,51.31 U$4.T1 17.65,51.56 15.49,51.56 v15.37,51.69 | E14.7 72.39,52.07 C14.2 73.79,51.94 99.95,51.94 100.08,51.82 | 100.08,51.82 100.33,52.07 C15.2 | 100.08,51.82 E15.7 | E11.7 71.76,38.73 73.03,38.73 C11.2 73.79,39.24 99.95,39.24 100.08,39.12 | 100.08,39.12 100.33,39.37 C12.2 101.73,39.24 103,39.24 R7.1 | 100.08,39.12 E12.7 | C9.2 100.33,26.67 E9.7 96.65,27.81 74.8,27.81 C8.2 72.39,26.67 E8.7 70.99,25.53 70.1,25.53 69.09,26.54 51.31,26.54 | E7.7 44.45,26.67 C7.2 45.85,26.54 51.31,26.54 | 51.31,26.54 v51.31,27.94
H1  (via drill 0.61)
  Top 0.381: v15.37,22.86 8,22.86 8,23.11 U$1.H1 | E1.10 37.47,10.79 37.47,12.95 36.96,13.46 v36.96,16.89 | v62.99,16.38 63.5,15.88 E5.4 | v62.23,37.34 62.1,37.47 62.1,44.32 60.96,45.47 E11.12 61.09,45.85 61.09,49.28 62.1,50.29 62.1,57.02 E14.11 | v49.02,18.54 48.77,18.8 v48.77,33.4 | U$4.H1 19.18,24.26 v19.18,25.02 | v36.45,27.94 35.56,28.83 E7.11
  Bottom 0.381: v15.37,22.86 U$4.H1 | 49.02,16.89 56.52,16.89 57.02,16.38 v62.99,16.38 | 49.02,16.89 v36.96,16.89 | E7.11 36.2,33.66 37.08,33.66 37.59,34.16 39.12,34.16 39.24,34.04 40.01,34.04 40.13,34.16 43.69,34.16 43.82,34.04 48.77,34.04 | 48.77,34.04 55.25,34.04 55.63,34.42 59.31,34.42 v62.23,37.34 | v49.02,18.54 49.02,16.89 | 48.77,34.04 v48.77,33.4 | v19.18,25.02 20.32,26.16 25.91,26.16 27.69,27.94 v36.45,27.94
H2  (via drill 0.61)
  Top 0.381: E13.4 36.96,49.4 36.96,39.24 E10.5 38.74,37.47 38.74,34.04 39.24,33.53 39.24,28.07 v38.74,27.56 | E1.13 31.62,11.3 v31.62,15.62 | v37.97,18.67 38.1,18.8 E4.10 | U$4.H2 21.72,22.73 v21.72,18.67
  Bottom 0.381: U$4.H2 20.19,24 8.76,24 U$1.H2 | 33.91,17.91 34.67,18.67 v37.97,18.67 | 33.91,17.91 v31.62,15.62 | E4.10 37.97,21.59 37.97,22.73 E7.6 40.77,25.53 v38.74,27.56 | v21.72,18.67 22.35,18.03 33.78,18.03 33.91,17.91
J1  (via drill 0.61)
  Top 0.381: v15.37,26.04 8,26.04 8,26.29 U$1.J1 | E11.10 65.79,45.97 65.79,50.55 E14.5 | E7.8 44.58,31.62 44.58,29.08 | 44.58,29.08 44.58,25.15 48.01,21.72 48.01,12.83 | 48.01,12.83 48.01,10.41 53.59,4.83 | E2.1 53.59,4.83 | v48.13,12.83 48.01,12.83 | v77.34,47.75 80.14,50.55 80.14,59.94 81.53,61.34 v82.17,61.34 | v98.81,0.89 82.68,0.89 v82.68,1.65 | v53.72,4.95 53.59,4.83 | U$4.J1 19.18,27.43 v19.18,28.19 | v21.34,29.46 22.1,30.23 v22.1,52.32 | v48.9,52.83 50.29,51.44 50.29,38.23 46.86,34.8 46.86,31.24 44.7,29.08 44.58,29.08
  Bottom 0.381: v15.37,26.04 U$4.J1 | E5.5 64.9,12.83 v48.13,12.83 | E11.10 67.18,46.86 69.09,46.86 69.22,46.74 70.49,46.74 71.5,47.75 v77.34,47.75 | v82.17,61.34 83.95,59.56 100.84,59.56 111.89,48.51 111.89,0.89 v98.81,0.89 | v82.68,1.65 79.38,4.95 v53.72,4.95 | v19.18,28.19 20.32,29.34 21.21,29.34 v21.34,29.46 | v22.1,52.32 22.48,52.7 25.91,52.7 27.18,53.98 47.75,53.98 v48.9,52.83
J2  (via drill 0.61)
  Top 0.381: v42.67,15.88 42.67,19.56 E4.9 41.78,22.73 41.78,33.53 41.28,34.04 41.28,37.47 E10.6 | E13.8 44.2,58.42 46.99,61.21 73.53,61.21 73.53,58.93 76.33,56.13 v76.33,23.24 | v60.96,23.24 E8.3 | U$4.J2 22.73,24.89 22.73,7.49 21.72,6.48 v21.72,2.92 | v31.62,3.56 33.02,4.95 E1.12
  Bottom 0.381: U$4.J2 20.19,27.18 8.76,27.18 U$1.J2 | E1.12 34.42,11.56 40.26,11.56 42.04,13.34 42.04,15.88 v42.67,15.88 | v76.33,23.24 75.82,22.73 60.96,22.73 | 60.96,22.73 41.78,22.73 E4.9 | 60.96,22.73 v60.96,23.24 | v21.72,2.92 24,0.64 30.23,0.64 31.62,2.03 v31.62,3.56
K1  (via drill 0.61)
  Top 0.381: v15.37,29.21 8,29.21 8,29.46 U$1.K1 | E14.6 E11.9 67.95,45.09 67.95,39.12 67.18,38.35 67.18,17.4 v66.17,16.38 E5.6 | E8.1 56.13,25.15 56.13,23.88 57.28,22.73 57.28,17.4 | 57.28,17.4 57.28,12.95 59.56,10.67 59.56,3.68 E2.2 | v57.4,17.4 57.28,17.4 | U$4.K1 18.67,29.21 18.8,29.34 20.32,29.34 20.32,29.08 v21.84,27.56
  Bottom 0.381: v15.37,29.21 U$4.K1 | v66.17,16.38 65.15,17.4 v57.4,17.4 | v21.84,27.56 22.99,28.7 35.81,28.7 36.07,28.96 38.74,28.96 42.04,25.65 42.04,24.26 54.74,24.26 E8.1
K2  (via drill 0.61)
  Top 0.381: E14.1 54.74,49.66 54.74,45.21 54.99,44.96 54.99,38.99 E11.1 54.74,36.96 54.74,29.97 | E2.3 62.1,3.68 62.1,15.88 61.98,16 61.98,19.43 | 61.98,19.43 61.98,20.95 62.36,21.34 62.36,24.26 E8.4 | v61.85,19.43 61.98,19.43 | 54.74,29.97 54.74,28.19 57.15,25.78 v57.15,24.64 | v54.61,29.97 54.74,29.97
  Bottom 0.381: U$1.K2 8.76,30.35 20.19,30.35 U$4.K2 27.69,30.48 28.7,29.46 34.29,29.46 35.69,30.86 35.69,31.88 36.2,31.88 36.32,32 37.47,32 38.99,30.48 50.67,30.48 51.18,29.97 v54.61,29.97 | E4.8 43.18,19.18 48.26,19.18 48.64,19.56 61.72,19.56 v61.85,19.43 | v57.15,24.64 57.53,24.26 62.36,24.26 E8.4
L1  (via drill 0.61)
  Top 0.381: v15.37,32.38 8,32.38 8,32.64 U$1.L1 | E2.5 69.85,6.35 v69.85,10.92 | v59.82,11.81 59.82,24 E8.2 58.29,25.53 58.29,25.78 57.28,26.8 57.28,42.16 v58.67,43.56 | E11.8 70.36,44.96 v70.36,43.56 | v24.38,31.5 25.02,30.86 25.02,11.05 24.64,10.67 v24.64,9.65 | v29.08,8.13 29.46,7.75 v29.46,6.1
  Bottom 0.381: v15.37,32.38 U$4.L1 18.54,31.62 24.26,31.62 v24.38,31.5 | E6.1 72.9,13.97 v69.85,10.92 69.98,11.3 60.33,11.3 v59.82,11.81 | v58.67,43.56 v70.36,43.56 | v24.64,9.65 26.16,8.13 v29.08,8.13 | v29.46,6.1 30.23,5.33 36.96,5.33 39.5,2.79 39.5,0.64 64.14,0.64 E2.5
L2  (via drill 0.61)
  Top 0.381: E2.4 64.9,3.94 64.9,18.03 66.04,19.18 E5.10 E8.5 66.04,25.65 62.99,28.7 62.99,29.84 62.36,30.48 62.36,33.27 58.67,36.96 58.67,37.85 E11.2 | E14.2 58.42,56.77 57.02,58.17 57.02,58.93 55.5,60.45 51.69,60.45 v51.69,40.77 | v26.42,37.85 26.8,38.23 v26.8,40.26 | v39.62,39.88 v38.23,41.27
  Bottom 0.381: U$1.L2 8.76,33.53 20.19,33.53 U$4.L2 24,37.34 25.91,37.34 v26.42,37.85 | E11.2 57.28,36.96 54.74,36.96 54.74,37.72 v51.69,40.77 51.56,40.64 45.34,40.64 44.83,40.13 39.88,40.13 v39.62,39.88 | v26.8,40.26 27.81,41.27 v38.23,41.27
M1  (via drill 0.61)
  Top 0.381: U$1.M1 8,35.94 8,36.2 17.15,36.2 U$4.M1 16.89,34.67 16.89,33.15 16.64,32.89 v16.64,9.14 | v72.64,9.91 72.52,9.78 72.52,6.48 E2.6 68.45,2.41 68.45,1.4 62.99,1.4 62.74,1.65 v62.36,1.65 | v59.94,31.5 E8.13 | E15.12 85.22,54.74 85.22,46.86 E12.13 85.22,44.58 85.22,32.77 v83.95,31.5 84.96,30.48 84.96,24.89 84.84,24.77 84.84,23.62 84.96,23.5 84.96,21.34 86.23,20.07 86.23,14.1 E6.2
  Bottom 0.381: v72.64,9.91 75.57,12.83 84.33,12.83 85.47,13.97 E6.2 | v59.94,31.5 60.45,30.99 72.77,30.99 73.15,30.61 83.06,30.61 v83.95,31.5 | v16.64,9.14 16.76,9.02 19.43,9.02 19.81,9.4 23.5,9.4 25.53,7.37 28.45,7.37 28.7,7.11 34.16,7.11 35.18,6.1 38.74,6.1 42.04,2.79 42.04,1.4 62.1,1.4 v62.36,1.65
M2  (via drill 0.61)
  Top 0.381: E2.9 68.83,10.41 68.83,12.57 69.72,13.46 69.72,20.45 E5.9 69.09,21.34 69.09,24.89 E8.6 68.2,25.78 v68.2,27.56 | v62.36,48.9 62.36,45.21 62.87,44.7 62.87,38.73 E11.4 64.64,36.96 64.64,32.77 65.02,32.38 65.02,30.1 v66.17,28.96 | v35.56,35.43 36.7,34.29 v36.7,30.99
  Bottom 0.381: U$1.M2 8.76,36.7 20.19,36.7 U$4.M2 21.59,38.1 25.27,38.1 26.42,39.24 30.99,39.24 31.88,38.35 31.88,36.2 32.64,36.2 33.4,35.43 v35.56,35.43 | v62.36,48.9 62.36,50.8 E14.3 | v68.2,27.56 66.8,28.96 v66.17,28.96 50.93,28.96 50.17,29.72 37.97,29.72 v36.7,30.99
N1  (via drill 0.61)
  Top 0.381: U$4.N1 17.15,39.37 8,39.37 8,39.12 U$1.N1 | E15.11 87.76,54.74 87.76,50.29 88.27,49.78 88.27,46.35 E12.12 88.27,45.09 88.27,39.12 87.76,38.61 87.76,20.83 88.14,20.45 88.14,16.26 v88.27,16.13 88.9,15.49 E6.3 | E3.1 84.07,2.79 v84.07,8.64 | E8.12 61.6,32.38 61.6,29.97 | 61.6,29.97 61.6,28.96 64.9,25.65 v64.9,19.43 | v42.16,42.29 44.58,39.88 44.58,38.48 v44.83,38.23 | v50.04,36.58 50.29,36.32 v50.29,32 | v61.47,29.97 61.6,29.97
  Bottom 0.381: v84.07,8.64 85.22,9.78 85.22,12.57 87.5,12.57 E6.3 | v64.9,19.43 66.17,18.16 83.06,18.16 85.09,16.13 v88.27,16.13 | U$4.N1 17.91,38.86 24,38.86 27.43,42.29 v42.16,42.29 | v44.83,38.23 46.48,36.58 v50.04,36.58 | v50.29,32 51.31,30.99 58.67,30.99 59.69,29.97 v61.47,29.97
N2  (via drill 0.61)
  Top 0.381: E2.8 71.88,10.92 71.88,13.08 72.26,13.46 72.26,20.45 E5.8 69.98,22.73 v69.98,27.05 | v66.8,48.9 67.18,48.51 67.18,39.5 66.04,38.35 E11.5 | v64.01,29.97 63.5,30.48 E8.11 | v25.78,44.96 25.53,45.21 v25.53,53.72 | v44.2,57.28 45.21,58.29 49.78,58.29 v49.78,53.85
  Bottom 0.381: U$1.N2 8.76,39.88 20.19,39.88 U$4.N2 21.59,41.27 22.1,41.27 v25.78,44.96 | E8.11 63.5,36.96 64.9,36.96 E11.5 | v66.8,48.9 65.41,48.9 E14.4 61.47,52.83 50.8,52.83 v49.78,53.85 | v69.98,27.05 69.98,29.97 v64.01,29.97 | v25.53,53.72 24.26,54.99 24.26,57.15 35.94,57.15 36.07,57.28 v44.2,57.28
P1  (via drill 0.61)
  Top 0.381: U$4.P1 17.15,42.55 8,42.55 8,42.29 U$1.P1 | E15.5 E12.10 | E3.2 85.22,3.68 85.22,10.41 82.68,12.95 82.68,24.26 E9.1 81.92,27.3 81.92,40.51 | 81.92,40.51 v81.92,46.86 | v53.72,46.61 53.98,46.35 v53.98,40.77 | v81.66,40.51 81.92,40.51
  Bottom 0.381: E3.2 90.3,6.48 90.3,13.97 E6.4 | E12.10 92.84,46.86 v81.92,46.86 | U$4.P1 17.91,42.04 21.46,42.04 26.29,46.86 50.17,46.86 50.42,46.61 v53.72,46.61 | v53.98,40.77 55.25,39.5 72.14,39.5 73.15,40.51 v81.66,40.51
P2  (via drill 0.61)
  Top 0.381: E3.3 87.76,3.68 87.76,14.22 87,14.99 87,20.95 E6.13 85.85,22.1 v85.85,24 | E14.8 70.1,57.4 70.1,51.44 69.72,51.05 69.72,48.64 | v69.72,47.75 69.72,48.64 | E11.6 68.96,38.48 v68.96,40.51 | v71.63,43.56 72.26,44.2 72.26,46.23 69.85,48.64 69.72,48.64 | v80.77,26.8 77.34,30.23 v77.34,42.55
  Bottom 0.381: E8.10 66.04,34.42 68.58,36.96 E11.6 | U$1.P2 8.76,43.05 20.19,43.05 U$4.P2 20.45,43.31 21.21,43.31 25.78,47.88 69.6,47.88 v69.72,47.75 | v68.96,40.51 69.22,40.77 70.36,40.77 71.63,42.04 71.63,42.55 | v71.63,43.56 71.63,42.55 | v85.85,24 85.6,24.26 83.31,24.26 v80.77,26.8 | 71.63,42.55 v77.34,42.55
R1  (via drill 0.61)
  Top 0.381: U$4.R1 17.15,45.72 8,45.72 8,45.47 U$1.R1 | E12.9 E15.6 v94.36,52.96 | v92.71,9.4 92.84,9.53 92.84,12.83 E6.5 92.84,15.11 92.84,22.48 v93.22,22.86 95.12,24.77 95.12,25.65 97.66,28.19 97.66,33.27 100.2,35.81 100.2,45.09 v100.58,45.47 | v56.77,49.66 57.53,48.9 v57.53,46.86 | v64.52,46.74 64.9,47.12 64.9,51.31 66.93,53.34 v69.09,53.34
  Bottom 0.381: E3.5 93.98,9.02 93.09,9.02 v92.71,9.4 | E9.2 88.14,23.62 92.46,23.62 v93.22,22.86 | E15.6 100.58,46.74 v100.58,45.47 | U$4.R1 17.91,45.21 21.97,45.21 26.42,49.66 v56.77,49.66 | v57.53,46.86 64.39,46.86 v64.52,46.74 | v69.09,53.34 69.22,53.21 85.6,53.21 85.98,52.83 94.23,52.83 v94.36,52.96
R2  (via drill 0.61)
  Top 0.381: E12.1 82.68,39.24 82.68,46.23 82.93,46.48 82.93,49.91 E15.1 82.68,51.94 82.68,58.17 v82.3,58.55 | E8.9 70.99,30.61 70.99,27.3 v72.77,25.53 72.9,25.4 72.9,24.13 74.8,22.23 74.8,16.51 v82.17,9.14 | v16.26,48.64 16.64,49.02 v16.64,56.77
  Bottom 0.381: U$4.R2 20.19,46.23 16.26,46.23 | 16.26,46.23 8.76,46.23 U$1.R2 | E8.9 73.66,38.1 E12.1 | E6.12 87.5,22.99 77.98,22.99 75.44,25.53 v72.77,25.53 | E3.4 90.3,1.4 85.85,1.4 84.96,2.29 84.96,7.62 83.69,7.62 v82.17,9.14 | v16.26,48.64 16.26,46.23 | v16.64,56.77 16.76,56.64 19.43,56.64 20.7,57.91 21.21,57.91 24.89,61.59 79.25,61.59 v82.3,58.55
S1  (via drill 0.61)
  Top 0.381: U$1.S1 8,48.51 13.84,48.51 14.73,47.62 16.64,47.62 17.27,48.26 U$4.S1 19.18,49.66 19.18,53.21 20.7,54.74 22.1,54.74 24.64,57.28 26.29,57.28 v26.29,55.24 | E3.6 97.16,3.17 98.04,3.17 98.93,4.06 98.93,6.1 95.38,9.65 95.38,11.94 96.52,13.08 E6.6 | v97.79,37.34 97.92,37.47 97.92,44.32 99.06,45.47 E12.8 | v102.49,14.1 102.74,14.35 v102.74,32.77
  Bottom 0.381: E9.13 88.52,35.18 95.63,35.18 | v97.79,37.34 95.63,35.18 | E6.6 97.66,12.83 101.22,12.83 v102.49,14.1 | v102.74,32.77 102.74,33.4 103,33.66 103,35.05 95.76,35.05 95.63,35.18 | v26.29,55.24 26.67,54.86 55.75,54.86 57.02,53.59 67.44,53.59 69.98,51.05 69.98,48.77 92.84,48.77 94.74,46.86 97.92,46.86 E12.8
S2  (via drill 0.61)
  Top 0.381: E3.13 85.98,10.54 85.98,12.7 85.22,13.46 v85.22,17.4 | v90.93,19.43 91.44,19.94 E6.11 | E12.2 86.36,38.35 87.5,39.5 87.5,46.23 87,46.74 87,50.16 E15.2 v86.36,53.85 | v77.6,20.57 74.8,23.37 74.8,28.7 71.12,32.38 E8.8 | v57.4,54.61 v54.61,51.82
  Bottom 0.381: U$1.S2 8,48.64 13.84,48.64 14.86,49.66 20.19,49.66 U$4.S2 21.34,50.55 26.04,50.55 27.43,51.94 44.2,51.94 45.34,50.8 53.59,50.8 v54.61,51.82 | v90.93,19.43 87.25,19.43 v85.22,17.4 82.04,20.57 v77.6,20.57 | E8.8 75.06,36.96 85.22,36.96 E12.2 | v57.4,54.61 57.66,54.36 85.85,54.36 v86.36,53.85
T2  (via drill 0.61)
  Top 0.381: E15.3 90.3,49.4 90.3,41.53 | 90.3,41.53 90.3,39.24 E12.4 92.58,36.96 92.58,24.89 90.3,22.61 v90.17,22.61 90.04,22.61 | E3.12 90.04,11.3 90.04,18.8 89.92,18.92 89.92,20.95 90.04,21.08 90.04,22.61 | 90.04,22.61 90.04,24.26 E9.3 | U$4.T2 21.08,52.7 21.84,53.47 23.37,53.47 23.37,54.23 v25.27,56.13 | v36.45,56.26 36.7,56.01 36.7,53.85 39.5,51.05 v39.5,43.56 | v71.88,40.89 v70.49,42.29 | v90.17,41.53 90.3,41.53
  Bottom 0.381: U$4.T2 14.73,52.7 13.84,51.82 8,51.82 U$1.T2 | E6.10 93.73,21.84 92.84,21.84 91.95,22.73 90.3,22.73 v90.17,22.61 | v25.27,56.13 25.4,56.26 v36.45,56.26 | v39.5,43.56 44.96,43.56 45.59,42.93 57.91,42.93 58.29,42.55 68.45,42.55 68.71,42.8 69.72,42.8 70.23,42.29 v70.49,42.29 | v71.88,40.89 72.52,41.53 v90.17,41.53
U1  (via drill 0.61)
  Top 0.381: v15.37,54.61 8,54.61 8,54.86 U$1.U1 | v109.09,34.04 102.74,34.04 | 102.74,34.04 v101.98,34.04 | v39.37,59.18 39.5,59.05 v39.5,56.26 | 102.74,34.04 v102.74,45.47
  Bottom 0.381: v15.37,54.61 U$4.U1 17.91,54.74 20.83,54.74 23.5,57.4 23.5,57.91 24.38,57.91 26.04,59.56 38.99,59.56 v39.37,59.18 | E3.10 99.19,4.95 104.27,4.95 R4.2 R5.1 109.35,2.67 111.13,2.67 111.13,32 v109.09,34.04 | E9.12 90.04,34.16 101.85,34.16 v101.98,34.04 | v39.5,56.26 39.75,56.01 53.34,56.01 54.61,57.28 72.14,57.28 73.15,58.29 81.15,58.29 83.06,56.39 98.93,56.39 102.74,52.58 v102.74,45.47
U2  (via drill 0.61)
  Top 0.381: E15.4 92.33,49.91 92.33,46.48 92.84,45.97 92.84,39.24 E12.5 | E3.9 96.39,10.29 96.39,11.81 97.66,13.08 97.66,20.45 E6.9 | v90.81,36.2 90.3,35.69 90.3,26.54 E9.4 | v74.55,59.31 79.12,54.74 v79.12,50.93
  Bottom 0.381: U$1.U2 8.76,55.75 20.19,55.75 U$4.U2 25.27,60.83 73.03,60.83 v74.55,59.31 | E9.4 92.46,24.38 93.35,24.38 96.14,21.59 E6.9 | E12.5 92.08,36.2 v90.81,36.2 | v79.12,50.93 80.39,49.66 90.3,49.66 E15.4
V1  (via drill 0.61)
  Top 0.381: v95.25,13.21 95.38,13.34 95.38,23.88 96.52,25.02 E9.6 | U$1.V1 8,58.17 8,58.42 17.15,58.42 U$4.V1 17.91,57.91 20.83,57.91 21.46,58.55 21.46,59.56 36.07,59.56 36.7,58.93 36.7,58.17 37.47,57.4 37.47,55.24 42.29,55.24 44.2,53.34 44.2,51.94 46.86,49.28 46.86,44.32 v49.28,41.91 | v75.31,29.59 74.8,30.1 74.8,36.07 v69.09,41.78
  Bottom 0.381: R6.1 R7.2 105.54,24.26 102.74,24.26 | E3.11 94.11,12.83 94.87,12.83 v95.25,13.21 | 102.74,24.26 97.66,24.26 E9.6 | 102.74,24.26 102.74,29.59 v75.31,29.59 | v69.09,41.78 49.4,41.78 v49.28,41.91
V2  (via drill 0.61)
  Top 0.381: E3.8 98.43,10.79 97.54,10.79 97.54,11.05 97.28,11.3 97.28,11.43 98.68,12.83 100.2,12.83 100.2,20.45 E6.8 | E9.5 93.98,25.65 95.12,26.8 95.12,33.27 95.76,33.91 95.76,37.34 E12.6 96.65,38.23 96.65,44.2 97.66,45.21 97.66,55.37 | E15.8 97.66,57.02 97.66,55.37 | U$4.V2 20.7,59.44 20.7,59.94 21.08,60.33 41.15,60.33 v41.15,59.82 | v54.86,56.13 v53.47,57.53 | v97.54,55.37 97.66,55.37
  Bottom 0.381: U$4.V2 20.19,58.93 8.76,58.93 U$1.V2 | E9.5 96.65,22.73 97.92,22.73 E6.8 | v41.15,59.82 41.4,59.56 51.44,59.56 v53.47,57.53 | v54.86,56.13 55.37,55.63 97.28,55.63 v97.54,55.37
VCC  (via drill 0.61)
  Top 0.381: E13.14 29.08,57.28 29.08,47.62 28.07,46.61 28.07,45.85 E10.14 28.58,45.09 28.58,39.12 29.08,38.61 29.08,36.45 28.07,35.43 28.07,33.15 E7.14 26.8,31.88 26.8,22.73 E4.14 27.94,15.62 29.08,14.48 29.08,13.46 28.58,12.95 28.58,10.79 E1.14 27.81,10.03 v27.81,6.35 | C4.1 44.58,19.18 44.58,10.03 C1.1 42.04,5.21 42.04,1.4 37.59,1.4 36.96,2.03 36.96,3.17 v36.7,3.43 | C13.1 47.88,54.99 v47.88,44.83 | C11.1 74.8,45.59 74.8,56.01 C14.1 72.77,58.04 72.77,59.31 v72.52,59.56
  Bottom 0.381: U$1.A2 8.76,4.95 20.19,4.95 U$4.A2 26.54,5.08 v27.81,6.35 29.59,4.57 35.56,4.57 v36.7,3.43 | C1.1 46.99,10.16 E2.14 57.15,8.89 C2.1 74.93,10.16 E3.14 | C3.1 104.27,11.56 108.08,11.56 R5.2 103.76,18.16 | 103.76,18.16 C6.1 101.47,20.45 84.96,20.45 E6.14 74.93,21.59 C5.1 73.53,20.45 57.02,20.45 E5.14 46.99,21.59 C4.1 | 47.88,44.45 54.61,44.45 E11.14 57.02,44.58 73.53,44.58 C11.1 74.93,45.72 E12.14 85.09,44.45 C12.1 | 47.88,44.45 C10.1 | 47.88,44.45 v47.88,44.83 | E14.14 57.02,59.56 v72.52,59.56 | C7.1 46.36,32.38 49.28,32.38 49.91,33.02 E8.14 57.02,31.88 58.93,31.88 59.82,32.77 59.82,33.78 60.07,33.78 60.45,34.16 61.47,34.16 62.36,33.27 62.36,31.88 73.53,31.88 C8.1 74.93,33.02 E9.14 84.96,31.88 101.47,31.88 C9.1 105.41,31.75 | 105.41,31.75 R6.2 109.09,35.69 109.09,36.96 C12.1 | C12.1 103.76,44.45 103.76,52.7 101.6,54.86 C15.1 101.47,57.28 84.96,57.28 E15.14 | 103.76,18.16 110.36,24.77 110.36,31.62 105.54,31.62 105.41,31.75

### Text on the board
tNames: M119 | Install Resistors Unless M111 or M115 | M117 | M115 | M113 | Fill Only One Column | M111